# Altium schematic sheet Sheet1.SchDoc
size A4
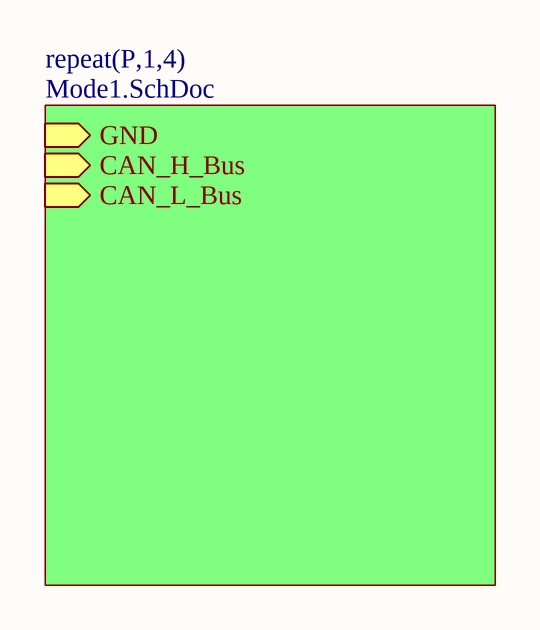
[diagram p0: Sheet1.SchDoc]

## Sub-sheets
repeat(P,1,4) = Mode1.SchDoc: GND (in), CAN_H_Bus (in), CAN_L_Bus (in)